# Altium schematic sheet SeptinaryAI_Balldi__elec_footprint__footprint_2021-12-06.schdoc
size 172 x 95 mm
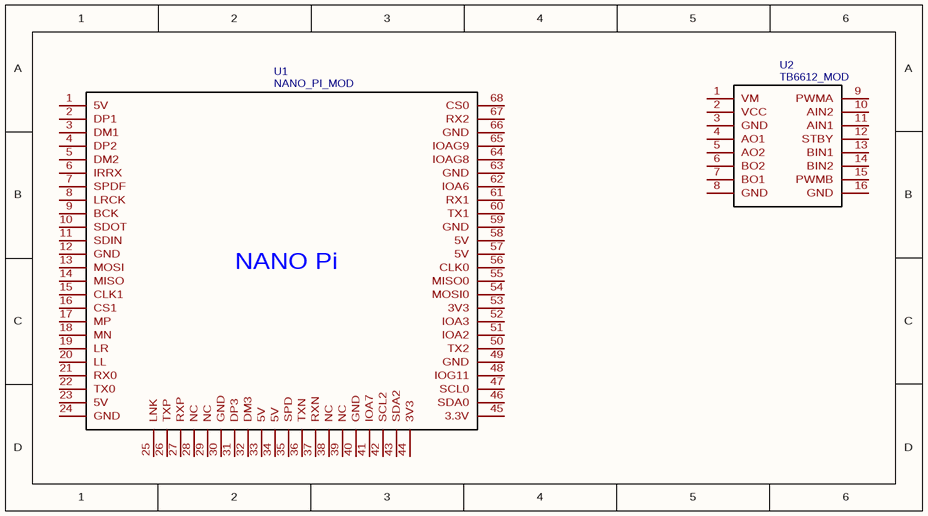
[diagram p0: SeptinaryAI_Balldi__elec_footprint__footprint_2021-12-06.schdoc]

## Parts
U1  NANO_PI_MOD  [NANO_PI_MOD]
U2  TB6612_MOD  [TB6612_FOOT]

## Nets

Not connected (* = marked no-connect by the designer): U1 1(5V) 2(DP1) 3(DM1) 4(DP2) 5(DM2) 6(IRRX) 7(SPDF) 8(LRCK) 9(BCK) 10(SDOT) 11(SDIN) 12(GND) 13(MOSI) 14(MISO) 15(CLK1) 16(CS1) 17(MP) 18(MN) 19(LR) 20(LL) 21(RX0) 22(TX0) 23(5V) 24(GND) 25(LNK) 26(TXP) 27(RXP) 28(NC) 29(NC) 30(GND) 31(DP3) 32(DM3) 33(5V) 34(5V) 35(SPD) 36(TXN) 37(RXN) 38(NC) 39(NC) 40(GND) 41(IOA7) 42(SCL2) 43(SDA2) 44(3V3) 45(3.3V) 46(SDA0) 47(SCL0) 48(IOG11) 49(GND) 50(TX2) 51(IOA2) 52(IOA3) 53(3V3) 54(MOSI0) 55(MISO0) 56(CLK0) 57(5V) 58(5V) 59(GND) 60(TX1) 61(RX1) 62(IOA6) 63(GND) 64(IOAG8) 65(IOAG9) 66(GND) 67(RX2) 68(CS0); U2 1(VM) 2(VCC) 3(GND) 4(AO1) 5(AO2) 6(BO2) 7(BO1) 8(GND) 9(PWMA) 10(AIN2) 11(AIN1) 12(STBY) 13(BIN1) 14(BIN2) 15(PWMB) 16(GND)

## Notes on the sheet
- (in symbol NANO_PI_MOD) NANO Pi

## Library data of the parts
U1 = NANO_PI_MOD: Contributor: sepai; spicePre: U; spiceSymbolName: NANO_PI_MOD
U2 = TB6612_MOD: Contributor: sepai; spicePre: U; spiceSymbolName: TB6612_MOD